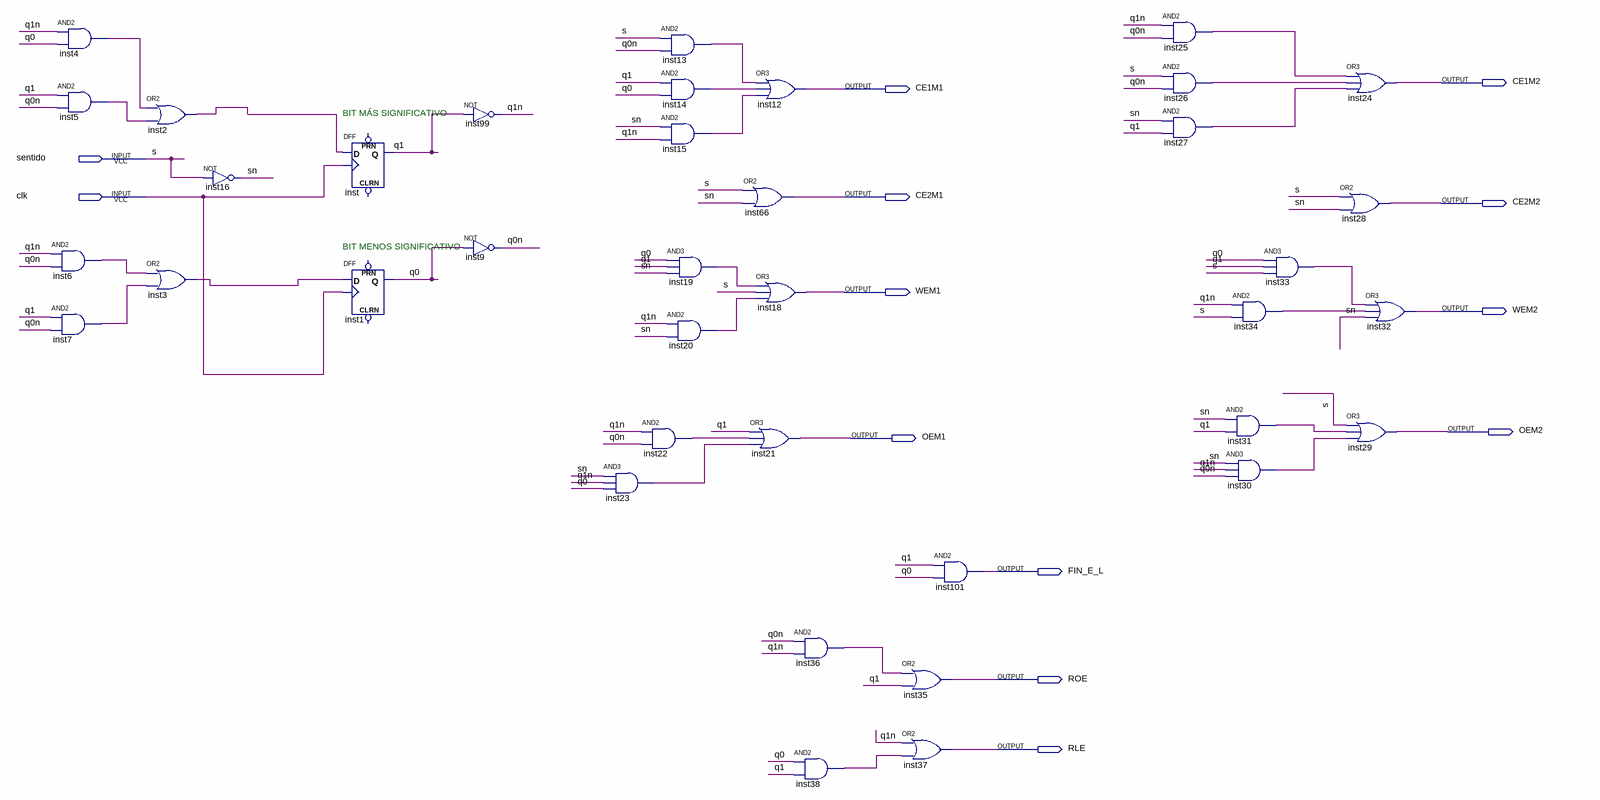
[diagram p0: schematic sheet]
// Quartus schematic Maquina_estado_seniales_memorias_registro.bdf as structural Verilog: 38 symbols, 13 pins
module Maquina_estado_seniales_memorias_registro (
  input  sentido,
  input  clk,
  output CE1M2,
  output CE1M1,
  output CE2M1,
  output CE2M2,
  output WEM1,
  output WEM2,
  output OEM2,
  output OEM1,
  output FIN_E_L,
  output ROE,
  output RLE
);

  wire inst2_out, inst3_out, inst4_out, inst5_out, inst6_out, inst7_out, inst13_out, inst14_out, inst15_out,
       inst19_out, inst20_out, inst22_out, inst23_out, inst25_out, inst26_out, inst27_out, inst30_out,
       inst31_out, inst33_out, inst34_out, inst36_out, inst38_out, q0, q0n, q1, q1n, sn;

  and inst4 (inst4_out, q1n, q0);
  and inst5 (inst5_out, q1, q0n);
  and inst6 (inst6_out, q1n, q0n);
  and inst7 (inst7_out, q1, q0n);
  or inst2 (inst2_out, inst4_out, inst5_out);
  or inst3 (inst3_out, inst6_out, inst7_out);
  not inst16 (sn, sentido);
  DFF inst (.CLK(clk), .D(inst2_out), .Q(q1));  // open: CLRN, PRN
  DFF inst1 (.CLK(clk), .D(inst3_out), .Q(q0));  // open: CLRN, PRN
  not inst99 (q1n, q1);
  not inst9 (q0n, q0);
  and inst23 (inst23_out, sn, q1n, q0);
  and inst13 (inst13_out, sentido, q0n);
  and inst14 (inst14_out, q1, q0);
  and inst15 (inst15_out, sn, q1n);
  and inst19 (inst19_out, q0, q1, sn);
  and inst20 (inst20_out, q1n, sn);
  and inst22 (inst22_out, q1n, q0n);
  or inst12 (CE1M1, inst13_out, inst14_out, inst15_out);
  or inst66 (CE2M1, sentido, sn);
  or inst18 (WEM1, inst19_out, sentido, inst20_out);
  or inst21 (OEM1, q1, inst22_out, inst23_out);
  and inst36 (inst36_out, q0n, q1n);
  and inst38 (inst38_out, q0, q1);
  and inst101 (FIN_E_L, q1, q0);
  or inst35 (ROE, inst36_out, q1);
  or inst37 (RLE, q1n, inst38_out);
  and inst25 (inst25_out, q1n, q0n);
  and inst26 (inst26_out, sentido, q0n);
  and inst27 (inst27_out, sn, q1);
  and inst34 (inst34_out, q1n, sentido);
  and inst31 (inst31_out, sn, q1);
  and inst30 (inst30_out, sn, q1n, q0n);
  and inst33 (inst33_out, q0, q1, sentido);
  or inst24 (CE1M2, inst25_out, inst26_out, inst27_out);
  or inst28 (CE2M2, sentido, sn);
  or inst29 (OEM2, sentido, inst31_out, inst30_out);
  or inst32 (WEM2, inst33_out, inst34_out, sn);

  // Other names for the same wires on the sheet: s = sentido

  // Notes on the sheet:
  //   BIT MÁS SIGNIFICATIVO
  //   BIT MENOS SIGNIFICATIVO
endmodule
